# Altium schematic sheet RS485.SchDoc
size A4
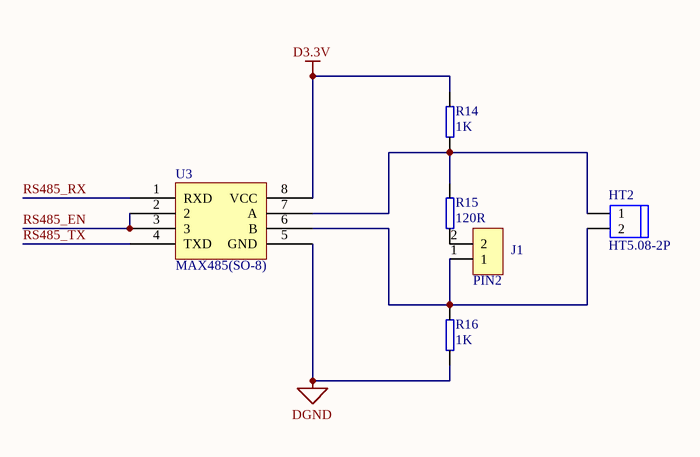
[diagram p0: RS485.SchDoc]

## Parts
HT2  HT5.08-2P  [HEAD2-5.08]
J1  PIN2  [PIN2-2.54]
R14  1K  [0805-RES]
R15  120R  [0805-RES]
R16  1K  [0805-RES]
U3  MAX485(SO-8)  [SOP8]

## Nets
D3.3V: R14.2 U3.8(VCC)
DGND: R16.1 U3.5(GND)
RS485_EN: U3.2 U3.3
RS485_RX: U3.1(RXD)
RS485_TX: U3.4(TXD)
NetHT2_1: HT2.1 R14.1 R15.2 U3.7(A)
NetHT2_2: HT2.2 J1.1 R16.2 U3.6(B)
NetJ1_2: J1.2 R15.1

## Library data of the parts
HT2 = HT5.08-2P: 5.08蓝色接口座子
R14-R16 = RES-1K